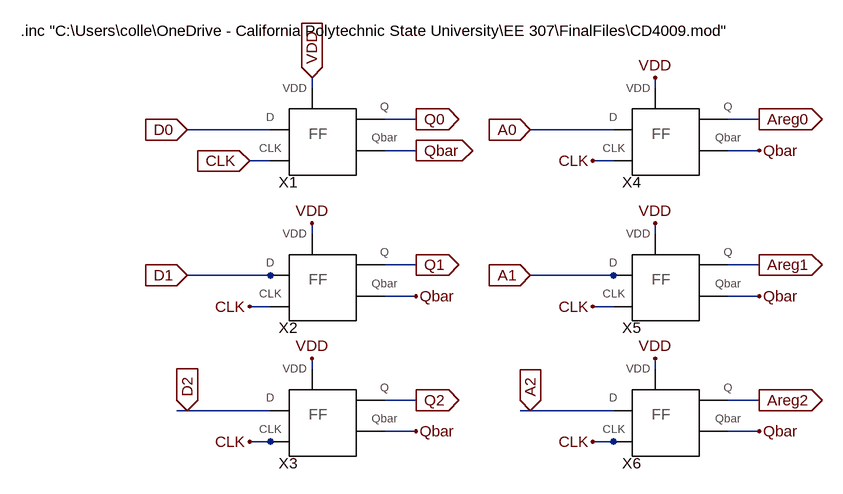
[diagram p0: schematic Reg_inc_6insteadof3bit.asc]
Reg_inc_6insteadof3bit.asc, the LTspice schematic file:
Version 4
SHEET 1 880 776
WIRE -80 160 -80 144
WIRE 448 160 448 144
WIRE 80 208 32 208
WIRE 608 208 560 208
WIRE -144 224 -272 224
WIRE 384 224 256 224
WIRE 80 256 32 256
WIRE 608 256 560 256
WIRE -144 272 -176 272
WIRE 384 272 352 272
WIRE -80 384 -80 368
WIRE 448 384 448 368
WIRE 80 432 32 432
WIRE 608 432 560 432
WIRE -144 448 -272 448
WIRE -128 448 -144 448
WIRE 384 448 256 448
WIRE 400 448 384 448
WIRE 80 480 32 480
WIRE 608 480 560 480
WIRE -144 496 -176 496
WIRE 384 496 352 496
WIRE -80 592 -80 576
WIRE 448 592 448 576
WIRE 80 640 32 640
WIRE 608 640 560 640
WIRE -272 656 -288 656
WIRE -144 656 -272 656
WIRE 256 656 240 656
WIRE 384 656 256 656
WIRE 80 688 32 688
WIRE 608 688 560 688
WIRE -144 704 -176 704
WIRE -128 704 -144 704
WIRE 384 704 352 704
WIRE 400 704 384 704
FLAG -80 144 VDD
IOPIN -80 144 In
FLAG -80 368 VDD
FLAG -80 576 VDD
FLAG -272 224 D0
IOPIN -272 224 In
FLAG -272 448 D1
IOPIN -272 448 In
FLAG -272 656 D2
IOPIN -272 656 In
FLAG 80 640 Q2
IOPIN 80 640 Out
FLAG 80 432 Q1
IOPIN 80 432 Out
FLAG 80 208 Q0
IOPIN 80 208 Out
FLAG 80 256 Qbar
IOPIN 80 256 Out
FLAG 80 480 Qbar
FLAG 80 688 Qbar
FLAG -176 272 CLK
IOPIN -176 272 In
FLAG -176 496 CLK
FLAG -176 704 CLK
FLAG 448 144 VDD
FLAG 448 368 VDD
FLAG 448 576 VDD
FLAG 256 224 A0
IOPIN 256 224 In
FLAG 256 448 A1
IOPIN 256 448 In
FLAG 256 656 A2
IOPIN 256 656 In
FLAG 608 640 Areg2
IOPIN 608 640 Out
FLAG 608 432 Areg1
IOPIN 608 432 Out
FLAG 608 208 Areg0
IOPIN 608 208 Out
FLAG 608 256 Qbar
FLAG 608 480 Qbar
FLAG 608 688 Qbar
FLAG 352 272 CLK
FLAG 352 496 CLK
FLAG 352 704 CLK
SYMBOL FlipFlop -80 208 R0
SYMATTR InstName X1
SYMBOL FlipFlop -80 432 R0
SYMATTR InstName X2
SYMBOL FlipFlop -80 640 R0
SYMATTR InstName X3
SYMBOL FlipFlop 448 208 R0
SYMATTR InstName X4
SYMBOL FlipFlop 448 432 R0
SYMATTR InstName X5
SYMBOL FlipFlop 448 640 R0
SYMATTR InstName X6
TEXT -528 72 Left 2 !.inc "C:\\Users\\colle\\OneDrive - California Polytechnic State University\\EE 307\\FinalFiles\\CD4009.mod"

The netlist it stands for:
* Reg_inc_6insteadof3bit.asc
XX1 D0 CLK VDD Q0 Qbar FlipFlop  ; pins D CLK VDD Q Qbar
XX2 D1 CLK VDD Q1 Qbar FlipFlop  ; pins D CLK VDD Q Qbar
XX3 D2 CLK VDD Q2 Qbar FlipFlop  ; pins D CLK VDD Q Qbar
XX4 A0 CLK VDD Areg0 Qbar FlipFlop  ; pins D CLK VDD Q Qbar
XX5 A1 CLK VDD Areg1 Qbar FlipFlop  ; pins D CLK VDD Q Qbar
XX6 A2 CLK VDD Areg2 Qbar FlipFlop  ; pins D CLK VDD Q Qbar
.inc "C:\Users\colle\OneDrive - California Polytechnic State University\EE 307\FinalFiles\CD4009.mod"
.backanno
.end